# Altium project EV06P90A_EVB-LAN8670-RMII.PrjPCB
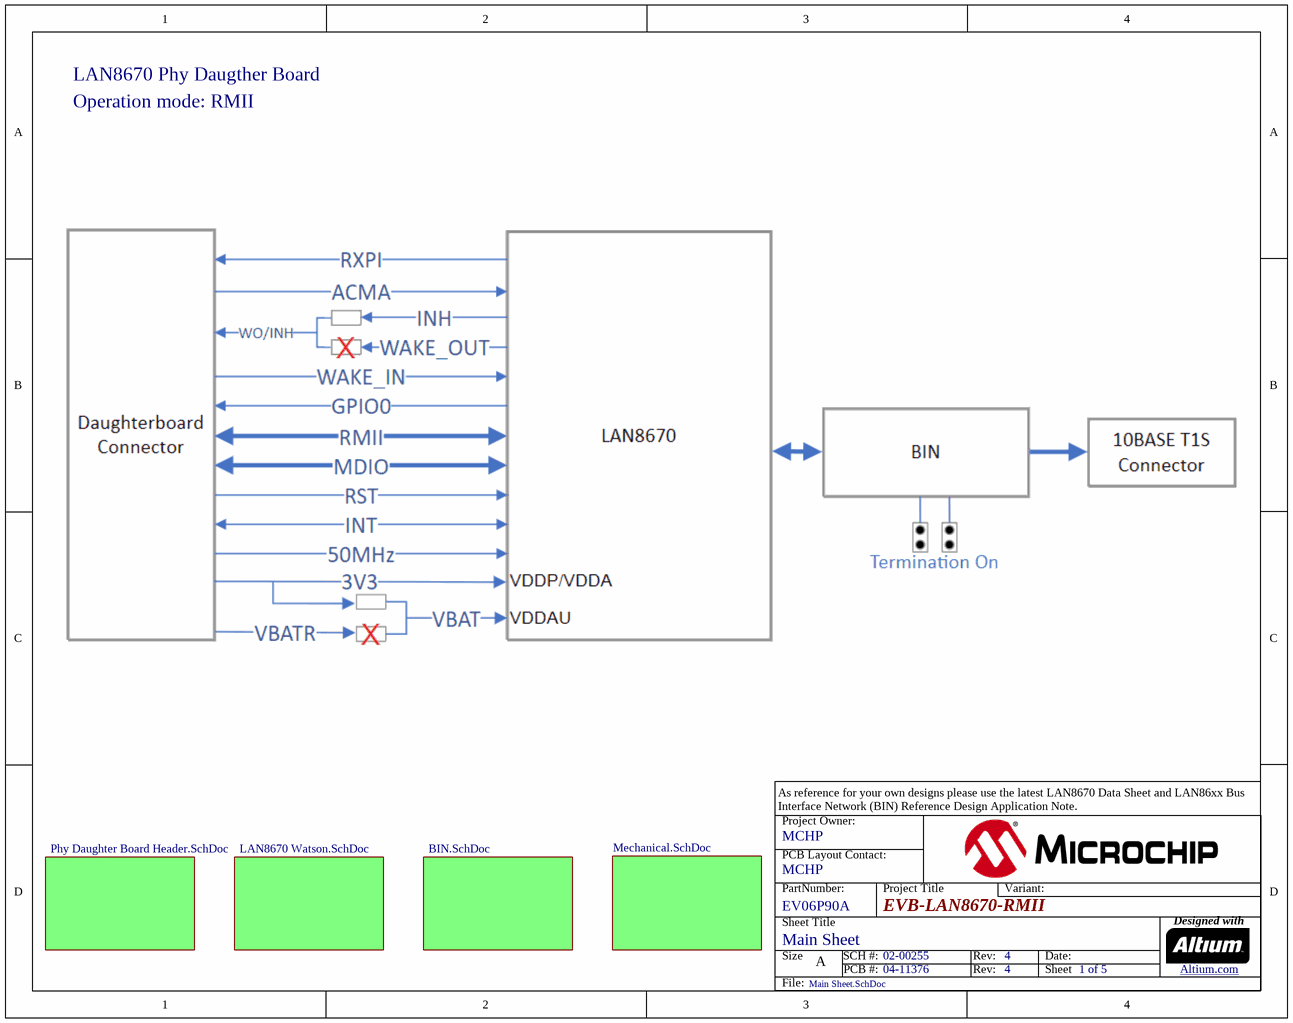
[diagram p0: Main Sheet.SchDoc]
ProjectTitle: EVB-LAN8670-RMII; ProjectPCBFabRevision: 4; ProjectPCBFabNumber: 04-11376; ProjectPCBAssyRevision: 4; ProjectPCBAssyNumber: 02-00255; ProjectPartNumber: EV06P90A; ProjectContactPCB: MCHP; ProjectContactOwner: MCHP
5 sheets, 76 parts. Net scope: global (net labels, ports and power ports of the same name join across sheets).
Board file: 04-11376.PcbDoc
Sheets:
  Main Sheet.SchDoc
     = BIN.SchDoc
     = Phy Daughter Board Header.SchDoc
     = LAN8670 Watson.SchDoc
     = Mechanical.SchDoc

## Sheet Main Sheet.SchDoc
size A; CompanyName: Microchip Technology Inc.; Organization: Microchip Technology; Address1: 2355 West Chandler Blvd.; Address2: Chandler, AZ  85224; Address4: USA; DocumentNumber: 1; SheetNumber: 1; SheetTotal: 5; SheetTitle: Main Sheet; Time: Time

### Sub-sheets
? = BIN.SchDoc: no entries
? = Phy Daughter Board Header.SchDoc: no entries
? = LAN8670 Watson.SchDoc: no entries
? = Mechanical.SchDoc: no entries

### Notes on the sheet
- LAN8670 Phy Daugther Board
- Operation mode: RMII
- As reference for your own designs please use the latest LAN8670 Data Sheet and LAN86xx Bus Interface Network (BIN) Reference Design Application Note.
- Project Owner:
- PCB Layout Contact:
- PartNumber:
- Project Title
- Variant:
- Sheet Title
- Size
- A
- SCH #:
- PCB #:
- Rev:
- Date:
- Sheet
- Designed with
- Altium.com <http://go.altium.com/MicrochipLandingPage_Evaluation.html>
- File:

## Sheet BIN.SchDoc
size A; CompanyName: Microchip Technology Inc.; Organization: Microchip Technology; Address1: 2355 West Chandler Blvd.; Address2: Chandler, AZ  85224; Address4: USA; DocumentNumber: 4; SheetNumber: 4; SheetTotal: 5; SheetTitle: Bus Interface Network; Time: Time
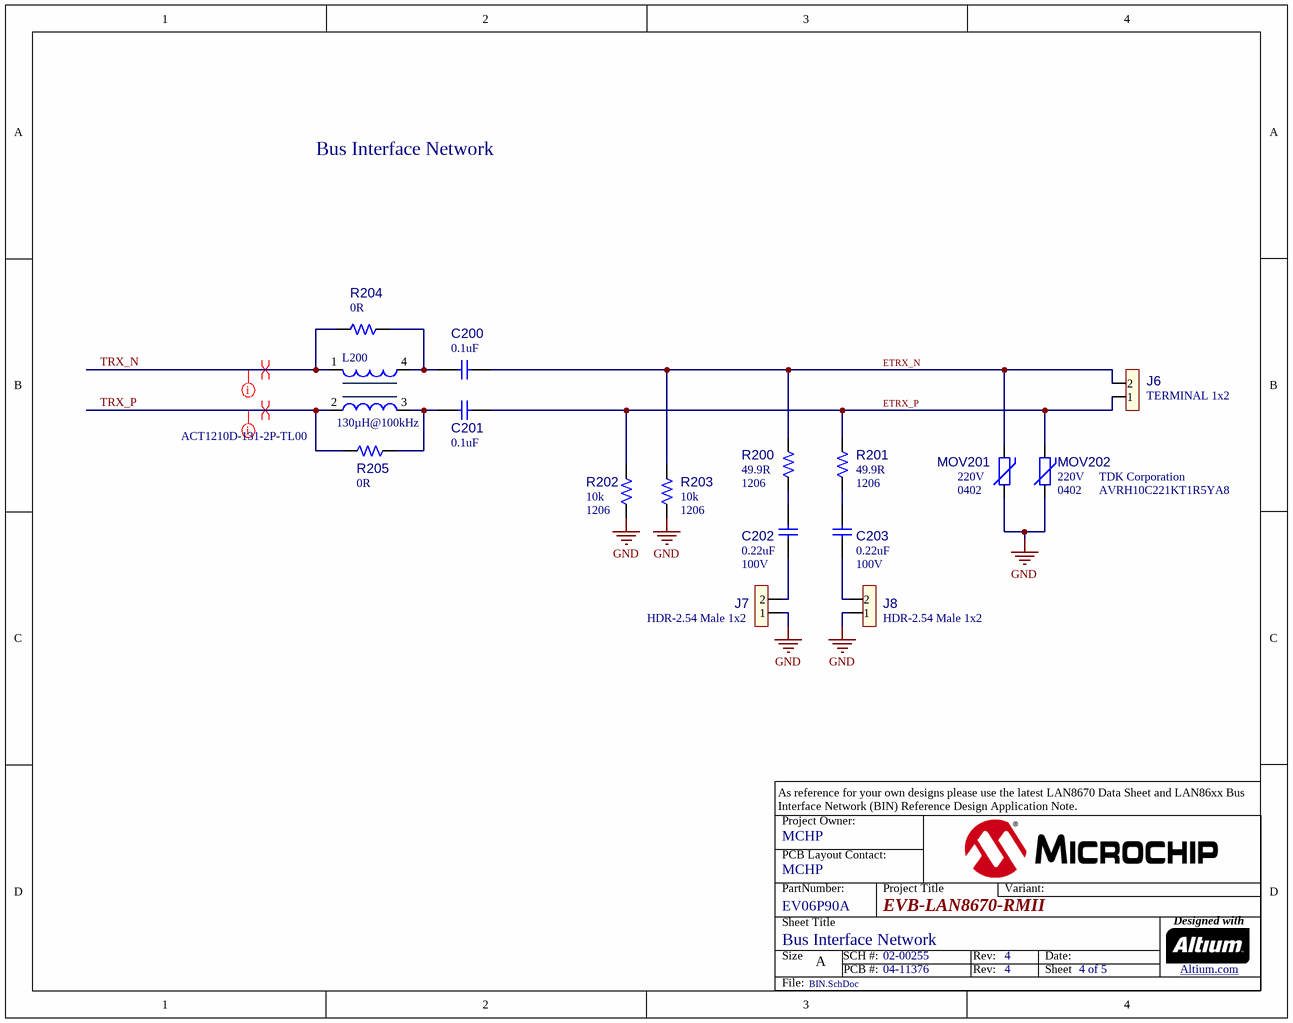
[diagram p1: BIN.SchDoc]

### Parts
C200  value 0.1uF  [CAP_C_0402]  (hidden comment: Capacitor NP)
C201  value 0.1uF  [CAP_C_0402]  (hidden comment: Capacitor NP)
C202  value 0.22uF  Voltage: 100V  [CAP_C_0805]  (hidden comment: Capacitor NP)
C203  value 0.22uF  Voltage: 100V  [CAP_C_0805]  (hidden comment: Capacitor NP)
J6  value TERMINAL 1x2  [CON_TB_3.5mm_2POS_WE_WR-TBL-691214110002S]  (hidden comment: Header 1x2)
J7  value HDR-2.54 Male 1x2  [HDR_M_2.54_1x2]  (hidden comment: Header 1x2)
J8  value HDR-2.54 Male 1x2  [HDR_M_2.54_1x2]  (hidden comment: Header 1x2)
L200  value 130µH@100kHz  Manufacturer Part Number 1: ACT1210D-131-2P-TL00  [IND_TDK_ACT1210D_L3.9W2.5H2.5]  (hidden comment: Inductor Choke ACT1210)
MOV201  value 220V  Package: 0402  [RES_C_0402]  (hidden comment: Varistor)
MOV202  value 220V  Package: 0402  Manufacturer 1: TDK Corporation  Manufacturer Part Number 1: AVRH10C221KT1R5YA8  [RES_C_0402]  (hidden comment: Varistor)
R200  value 49.9R  Package: 1206  [RES_C_1206]  (hidden comment: Resistor)
R201  value 49.9R  Package: 1206  [RES_C_1206]  (hidden comment: Resistor)
R202  value 10k  Package: 1206  [RES_C_1206]  (hidden comment: Resistor)
R203  value 10k  Package: 1206  [RES_C_1206]  (hidden comment: Resistor)
R204  value 0R  [RES_C_0402]  (hidden comment: Resistor)
R205  value 0R  [RES_C_0402]  (hidden comment: Resistor)

### Nets
GND: J7.1 J8.1 MOV201.1 MOV202.1 R202.2 R203.2
ETRX_N: C200.2 J6.2 MOV201.2 R200.2 R203.1
ETRX_P: C201.2 J6.1 MOV202.2 R201.2 R202.1
TRX_N: L200.1 R204.1
TRX_P: L200.2 R205.1
NetC200_1: C200.1 L200.4 R204.2
NetC201_1: C201.1 L200.3 R205.2
NetC202_1: C202.1 J7.2
NetC202_2: C202.2 R200.1
NetC203_1: C203.1 J8.2
NetC203_2: C203.2 R201.1

### Layout directives
differential pair: TRX_N, TRX_P
net class 100 Ohm Diff: TRX_N, TRX_P

### Notes on the sheet
- As reference for your own designs please use the latest LAN8670 Data Sheet and LAN86xx Bus Interface Network (BIN) Reference Design Application Note.
- Project Owner:
- PCB Layout Contact:
- PartNumber:
- Project Title
- Variant:
- Sheet Title
- Size
- A
- SCH #:
- PCB #:
- Rev:
- Date:
- Sheet
- Designed with
- Altium.com <http://go.altium.com/MicrochipLandingPage_Evaluation.html>
- File:

### Library data of the parts
C200 C201 = CAP2375: Manufacturer 1: Murata Electronics; Manufacturer Part Number 1: GRM155R71H104KE14J; Voltage: 50V; Tolerance: 10%; Description_: Ceramic capacitor, SMD 0402, X7R, 50V, +/-10%; Temperature Coeffcient: X7R; Type: Ceramic; Owner: Dragos Danaila; Populated: YES; Dev Tools Status: Production; MCHP-ID: CAP2375; Revision: 1; Status: MCL Design; Package: 0402; Operating Temperature: -55C to +125C; Category: Capacitor; Supplier 1: Mouser Electronics; Supplier Part Number 1: 81-GRM155R71H104KE4J; Quantity Override: 1; Symbol: Capacitor NP; ComponentLink1URL: https://chn-vm-apps.microchip.com/mchprepo/parts/Datasheets/murata_03052018_GRM_Series_1-1310166.pdf; ComponentLink1Description: SVN Datasheet; ComponentLink2URL: C:\ALTIUM_WORK\00001_MCHP-CDB\Datasheets\murata_03052018_GRM_Series_1-1310166.pdf; ComponentLink2Description: Local Datasheet; ComponentLink3URL: C:\ALTIUM_WORK\00001_MCHP-CDB\Library\LibraryRefs\Capacitor NP.SchLib; ComponentLink3Description: Open Symbol; ComponentLink4URL: C:\ALTIUM_WORK\00001_MCHP-CDB\Library\Footprints\CAP_C_0402.PcbLib; ComponentLink4Description: Open Footprint; ComponentLink5Description: Open Footprint 2; ComponentLink6Description: Open Footprint 3; ComponentLink7Description: Open Footprint 4
C202 C203 = CAP2522: Manufacturer 1: AVX Corporation; Manufacturer Part Number 1: 08051C224K4T2A; Description_: CAP CER 0.22uF 100V 10% X7R SMD 0805 AEC-Q200; Tolerance: ±10%; Type: Ceramic; Owner: Lori Graham; Populated: YES; Temperature Coeffcient: X7R; Dev Tools Status: Design; MCHP-ID: CAP2522; Package: 0805; Revision: 1; Status: MCL Design; Operating Temperature: -55°C to +125°C; Category: Capacitor; Supplier 1: Digi-Key; Supplier Part Number 1: 478-13049-1-ND; Quantity Override: 1; Symbol: Capacitor NP; ComponentLink1URL: https://chn-vm-apps.microchip.com/mchprepo/parts/Datasheets/AVX_08051C224K4T2A; ComponentLink1Description: SVN Datasheet; ComponentLink2URL: C:\ALTIUM_WORK\00001_MCHP-CDB\Datasheets\AVX_08051C224K4T2A; ComponentLink2Description: Local Datasheet; ComponentLink3URL: C:\ALTIUM_WORK\00001_MCHP-CDB\Library\LibraryRefs\Capacitor NP.SchLib; ComponentLink3Description: Open Symbol; ComponentLink4URL: C:\ALTIUM_WORK\00001_MCHP-CDB\Library\Footprints\CAP_C_0805.PcbLib; ComponentLink4Description: Open Footprint; ComponentLink5Description: Open Footprint 2; ComponentLink6Description: Open Footprint 3; ComponentLink7Description: Open Footprint 4
J6 = CON2397: Manufacturer 1: WUERTH ELEKTRONIK; Manufacturer Part Number 1: 691214110002S; Description_: CON TERMINAL 3.5mm 1x2 Female 16-30AWG 10A TH R/A; Owner: Lori Graham; Populated: YES; Dev Tools Status: Design; Voltage: 300V; Current: 10A; MCHP-ID: CON2397; Revision: 1; Status: MCL Design; Type: Terminal Block; Category: Connector; Supplier 1: Digi-Key; Supplier Part Number 1: 732-691214110002S-ND; Quantity Override: 1; Symbol: Header 1x2; ComponentLink1URL: https://chn-vm-apps.microchip.com/mchprepo/parts/Datasheets/6912141100xxS.pdf; ComponentLink1Description: SVN Datasheet; ComponentLink2URL: C:\ALTIUM_WORK\00001_MCHP-CDB\Datasheets\6912141100xxS.pdf; ComponentLink2Description: Local Datasheet; ComponentLink3URL: C:\ALTIUM_WORK\00001_MCHP-CDB\Library\LibraryRefs\Header 1x2.SchLib; ComponentLink3Description: Open Symbol; ComponentLink4URL: C:\ALTIUM_WORK\00001_MCHP-CDB\Library\Footprints\CON_TB_3.5mm_2POS_WE_WR-TBL-691214110002S.PcbLib; ComponentLink4Description: Open Footprint; ComponentLink5Description: Open Footprint 2; ComponentLink6Description: Open Footprint 3; ComponentLink7Description: Open Footprint 4; Operating Temperature: -30C to +120C
J7 J8 = CON2326: Manufacturer 1: Samtec Inc; Manufacturer Part Number 1: TSW-102-23-F-S; Description_: CON HDR-2.54 M 1x2 5.84MH TH VERT; Owner: Lori Graham; Populated: YES; Dev Tools Status: Design; MCHP-ID: CON2326; Revision: 1; Status: MCL Design; Type: Header 2.54mm; Category: Connector; Supplier 1: Digi-Key; Supplier Part Number 1: SAM10326-ND; Quantity Override: 1; Symbol: Header 1x2; ComponentLink1URL: https://chn-vm-apps.microchip.com/mchprepo/parts/Datasheets/Samtec_TSW_102-23-F-S; ComponentLink1Description: SVN Datasheet; ComponentLink2URL: C:\ALTIUM_WORK\00001_MCHP-CDB\Datasheets\Samtec_TSW_102-23-F-S; ComponentLink2Description: Local Datasheet; ComponentLink3URL: C:\ALTIUM_WORK\00001_MCHP-CDB\Library\LibraryRefs\Header 1x2.SchLib; ComponentLink3Description: Open Symbol; ComponentLink4URL: C:\ALTIUM_WORK\00001_MCHP-CDB\Library\Footprints\HDR_M_2.54_1x2.PcbLib; ComponentLink4Description: Open Footprint; ComponentLink5Description: Open Footprint 2; ComponentLink6Description: Open Footprint 3; ComponentLink7Description: Open Footprint 4; Operating Temperature: -55°C ~ 125°C
L200 = IND1953: Manufacturer 1: TDK Corporation; Description_: CM CHOKE 6.7k@10MHz 3.5R SMD 1210 AEC-Q200; Type: CM Choke; Owner: Joerg Buehrer; DCR: 3.5R; Dev Tools Status: Design; Test Frequency: 10MHz; Populated: YES; BOM Notes: Alternate:  ACT1210D-101-2P-TL00 or ACT1210R-101-2P-TL00; MCHP-ID: IND1953; Revision: 2; Status: MCL Design; Operating Temperature: -40°C ~ 150°C; Package: 1210; Category: Inductor; Supplier 1: TDK Corporation; Supplier Part Number 1: ACT1210D-131-2P-TL00; Quantity Override: 1; Symbol: Inductor Choke ACT1210; ComponentLink1URL: https://chn-vm-apps.microchip.com/mchprepo/parts/Datasheets/cmf_automotive_signal_act1210d_en.pdf; ComponentLink1Description: SVN Datasheet; ComponentLink2URL: C:\ALTIUM_WORK\00001_MCHP-CDB\Datasheets\cmf_automotive_signal_act1210d_en.pdf; ComponentLink2Description: Local Datasheet; ComponentLink3URL: C:\ALTIUM_WORK\00001_MCHP-CDB\Library\LibraryRefs\Inductor Choke ACT1210.SchLib; ComponentLink3Description: Open Symbol; ComponentLink4URL: C:\ALTIUM_WORK\00001_MCHP-CDB\Library\Footprints\IND_TDK_ACT1210D_L3.9W2.5H2.5.PcbLib; ComponentLink4Description: Open Footprint; ComponentLink5Description: Open Footprint 2; ComponentLink6Description: Open Footprint 3; ComponentLink7Description: Open Footprint 4
MOV201 = RES2490: Manufacturer 1: TDK Corporation; Manufacturer Part Number 1: AVRH10C221KT1R5YA8; Description_: RES VARISTOR C 220V 0.01J SMD 0402; Dev Tools Status: Design; Current: 1A; Owner: Sam Charles; Populated: YES; MCHP-ID: RES2490; Revision: 1; Symbol: Varistor; Status: MCL Design; ComponentLink1URL: https://chn-vm-apps.microchip.com/mchprepo/parts/Datasheets/vpd_automotive_varistors_avr_en.pdf; ComponentLink1Description: SVN Datasheet; ComponentLink2URL: C:\ALTIUM_WORK\00001_MCHP-CDB\Datasheets\vpd_automotive_varistors_avr_en.pdf; ComponentLink2Description: Local Datasheet; ComponentLink3URL: C:\ALTIUM_WORK\00001_MCHP-CDB\Library\LibraryRefs\Varistor.SchLib; ComponentLink3Description: Open Symbol; ComponentLink4URL: C:\ALTIUM_WORK\00001_MCHP-CDB\Library\Footprints\RES_C_0402.PcbLib; ComponentLink4Description: Open Footprint; ComponentLink5Description: Open Footprint 2; ComponentLink6Description: Open Footprint 3; ComponentLink7Description: Open Footprint 4; Operating Temperature: -55°C ~ 150°C; Category: Resistor; Type: Varistor; Voltage: 220V; Composition: C; Supplier 1: Digi-Key; Supplier Part Number 1: 445-AVRH10C221KT1R5YA8CT-ND; Quantity Override: 1
MOV202 = RES2490: Description_: RES VARISTOR C 220V 0.01J SMD 0402; Dev Tools Status: Design; Current: 1A; Owner: Sam Charles; Populated: YES; MCHP-ID: RES2490; Revision: 1; Symbol: Varistor; Status: MCL Design; ComponentLink1URL: https://chn-vm-apps.microchip.com/mchprepo/parts/Datasheets/vpd_automotive_varistors_avr_en.pdf; ComponentLink1Description: SVN Datasheet; ComponentLink2URL: C:\ALTIUM_WORK\00001_MCHP-CDB\Datasheets\vpd_automotive_varistors_avr_en.pdf; ComponentLink2Description: Local Datasheet; ComponentLink3URL: C:\ALTIUM_WORK\00001_MCHP-CDB\Library\LibraryRefs\Varistor.SchLib; ComponentLink3Description: Open Symbol; ComponentLink4URL: C:\ALTIUM_WORK\00001_MCHP-CDB\Library\Footprints\RES_C_0402.PcbLib; ComponentLink4Description: Open Footprint; ComponentLink5Description: Open Footprint 2; ComponentLink6Description: Open Footprint 3; ComponentLink7Description: Open Footprint 4; Operating Temperature: -55°C ~ 150°C; Category: Resistor; Type: Varistor; Voltage: 220V; Composition: C; Supplier 1: Digi-Key; Supplier Part Number 1: 445-AVRH10C221KT1R5YA8CT-ND; Quantity Override: 1
R200 R201 = RES2766: Manufacturer 1: Vishay Dale; Manufacturer Part Number 1: TNPW120649R9BEEA; Description_: RES TF 49.9R 0.1% 0.4W SMD 1206 AEC-Q200; Voltage: 200V; Tolerance: ±0.1%; Temperature Coeffcient: ±25ppm/°C; Power: 0.4W, 2/5W; Owner: Lori Graham; Populated: YES; Dev Tools Status: Design; MCHP-ID: RES2766; Revision: 2; Status: MCL Design; Operating Temperature: -55°C to +155°C; Category: Resistor; Type: RES SMD; Composition: TF; Supplier 1: Digi-Key; Supplier Part Number 1: TNP49.9ACCT-ND; Quantity Override: 1; Symbol: Resistor; ComponentLink1URL: https://chn-vm-apps.microchip.com/mchprepo/parts/Datasheets/tnpw_e3; ComponentLink1Description: SVN Datasheet; ComponentLink2URL: C:\ALTIUM_WORK\00001_MCHP-CDB\Datasheets\tnpw_e3; ComponentLink2Description: Local Datasheet; ComponentLink3URL: C:\ALTIUM_WORK\00001_MCHP-CDB\Library\LibraryRefs\Resistor.SchLib; ComponentLink3Description: Open Symbol; ComponentLink4URL: C:\ALTIUM_WORK\00001_MCHP-CDB\Library\Footprints\RES_C_1206.PcbLib; ComponentLink4Description: Open Footprint; ComponentLink5Description: Open Footprint 2; ComponentLink6Description: Open Footprint 3; ComponentLink7Description: Open Footprint 4
R202 R203 = RES2292: Manufacturer 1: Panasonic Electronic Components; Manufacturer Part Number 1: ERJ-8ENF1002V; Tolerance: 1%; Description_: RES TKF 10k 1% 1/4W SMD 1206 AEC-Q200; Dev Tools Status: Design; Temperature Coeffcient: 100ppm/C; Power: 1/4W; Owner: Gabor Bihari; Populated: YES; MCHP-ID: RES2292; Revision: A; Status: MCL Design; ComponentLink1URL: https://chn-vm-apps.microchip.com/mchprepo/parts/Datasheets/AOA0000C304.pdf; ComponentLink1Description: SVN Datasheet; Operating Temperature: -55°C - 155°C; Category: Resistor; Type: RES SMD; Composition: TKF; Supplier 1: Digi-Key; Supplier Part Number 1: P10.0KFCT-ND; Quantity Override: 1; Symbol: Resistor; ComponentLink2URL: C:\ALTIUM_WORK\00001_MCHP-CDB\Datasheets\AOA0000C304.pdf; ComponentLink2Description: Local Datasheet; ComponentLink3URL: C:\ALTIUM_WORK\00001_MCHP-CDB\Library\LibraryRefs\Resistor.SchLib; ComponentLink3Description: Open Symbol; ComponentLink4URL: C:\ALTIUM_WORK\00001_MCHP-CDB\Library\Footprints\RES_C_1206.PcbLib; ComponentLink4Description: Open Footprint; ComponentLink5Description: Open Footprint 2; ComponentLink6Description: Open Footprint 3; ComponentLink7Description: Open Footprint 4
R204 R205 = RSMT1246: Manufacturer 1: Panasonic Electronic Components; Manufacturer Part Number 1: ERJ-2GE0R00X; Tolerance: 50mOhm; Description_: RES TKF 0R 1/10W SMD 0402; Dev Tools Status: Design; Voltage: 50V; Current: 1A; Power: 1/10W; Owner: Dragos Danaila; Populated: Yes; MCHP-ID: RSMT1246; Package: 0402; Revision: A; Symbol: Resistor; Status: MCL Design; ComponentLink1URL: https://chn-vm-apps.microchip.com/mchprepo/parts/Datasheets/DMA0000COL9.pdf; ComponentLink1Description: SVN Datasheet; ComponentLink2URL: C:\ALTIUM_WORK\00001_MCHP-CDB\Datasheets\DMA0000COL9.pdf; ComponentLink2Description: Local Datasheet; ComponentLink3URL: C:\ALTIUM_WORK\00001_MCHP-CDB\Library\LibraryRefs\Resistor.SchLib; ComponentLink3Description: Open Symbol; ComponentLink4URL: C:\ALTIUM_WORK\00001_MCHP-CDB\Library\Footprints\RES_C_0402.PcbLib; ComponentLink4Description: Open Footprint; ComponentLink5Description: Open Footprint 2; ComponentLink6Description: Open Footprint 3; ComponentLink7Description: Open Footprint 4; Operating Temperature: -55C to +155C; Category: Resistor; Type: RES SMD; Composition: TKF; Supplier 1: Digi-Key; Supplier Part Number 1: P0.0JCT-ND; Quantity Override: 1

## Sheet Phy Daughter Board Header.SchDoc
size A; CompanyName: Microchip Technology Inc.; Organization: Microchip Technology; Address1: 2355 West Chandler Blvd.; Address2: Chandler, AZ  85224; Address4: USA; DocumentNumber: 2; SheetNumber: 2; SheetTotal: 5; SheetTitle: Phy Daughter Board Header; Time: Time
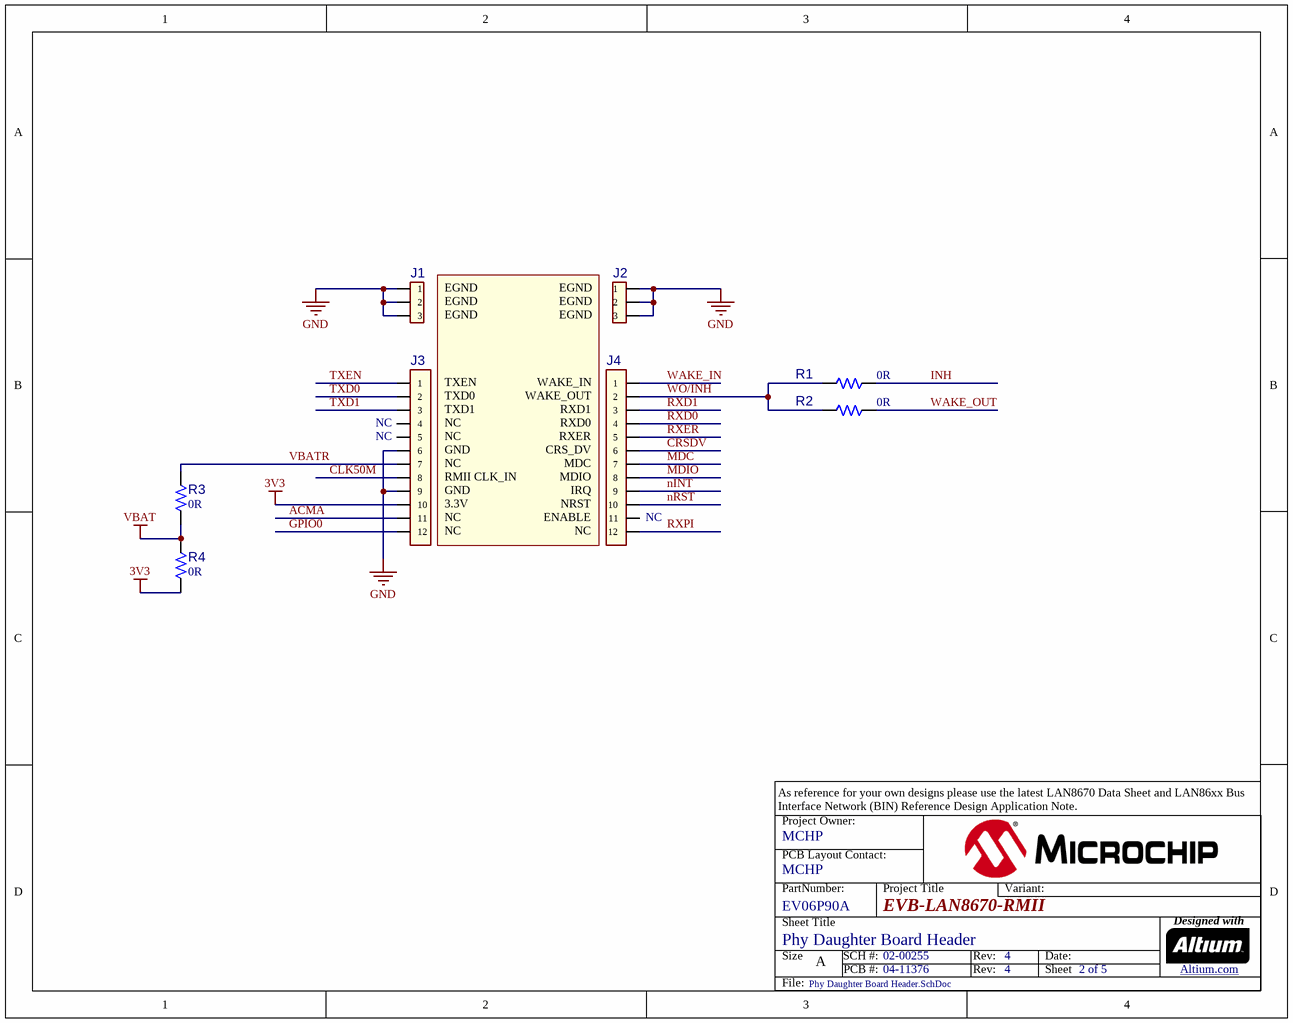
[diagram p2: Phy Daughter Board Header.SchDoc]

### Parts
J1  Header 1x3  [HDR_M_1.27_1x3_TMS_103-02_L_S]  (value not drawn)
J2  Header 1x3  [HDR_M_1.27_1x3_TMS_103-02_L_S]  (value not drawn)
J3  Header 1x12  [HDR_M_1.27_1x12]  (value not drawn)
J4  Header 1x12  [HDR_M_1.27_1x12]  (value not drawn)
R1  value 0R  [RES_C_0402]  (hidden comment: Resistor)
R2  value 0R  [RES_C_0402]  (hidden comment: Resistor)
R3  value 0R  [RES_C_0603]  (hidden comment: Resistor)
R4  value 0R  [RES_C_0603]  (hidden comment: Resistor)

### Nets
3V3: J3.10 R4.1
GND: J1.1 J1.2 J1.3 J2.1 J2.2 J2.3 J3.6 J3.9
VBAT: R3.1 R4.2
ACMA: J3.11
CLK50M: J3.8
CRSDV: J4.6
GPIO0: J3.12
INH: R1.2
MDC: J4.7
MDIO: J4.8
nINT: J4.9
nRST: J4.10
RXD0: J4.4
RXD1: J4.3
RXER: J4.5
RXPI: J4.12
TXD0: J3.2
TXD1: J3.3
TXEN: J3.1
VBATR: J3.7 R3.2
WAKE_IN: J4.1
WAKE_OUT: R2.2
WO/INH: J4.2 R1.1 R2.1

Not connected (* = marked no-connect by the designer): J3 4 5; J4 11

### Notes on the sheet
- (near J1) EGND
- (near J2) EGND
- (near J3) NC
- (near J3) TXEN
- (near J3) TXD0
- (near J3) TXD1
- (near J4) WAKE_IN
- (near J4) WAKE_OUT
- (near J4) RXD1
- (near J4) RXD0
- (near J3) GND
- (near J3) RMII CLK_IN
- (near J3) 3.3V
- (near J4) RXER
- (near J4) CRS_DV
- (near J4) MDC
- (near J4) MDIO
- (near J4) IRQ
- (near J4) NRST
- (near J4) ENABLE
- (near J4) NC
- As reference for your own designs please use the latest LAN8670 Data Sheet and LAN86xx Bus Interface Network (BIN) Reference Design Application Note.
- Project Owner:
- PCB Layout Contact:
- PartNumber:
- Project Title
- Variant:
- Sheet Title
- Size
- A
- SCH #:
- PCB #:
- Rev:
- Date:
- Sheet
- Designed with
- Altium.com <http://go.altium.com/MicrochipLandingPage_Evaluation.html>
- File:

### Library data of the parts
J1 J2 = CON1213: Manufacturer 1: Samtec; Manufacturer Part Number 1: TMS-103-02-L-S; Description_: CON HDR-1.27 Male 1X3 TH VERT; Owner: Leah Whitaker; Populated: YES; Dev Tools Status: Production; MCHP-ID: CON1213; Revision: 0; Status: MCL Design; Type: Header 1.27mm; Category: Connector; Supplier 1: Samtec; Supplier Part Number 1: TMS-103-02-L-S; Quantity Override: 1; Symbol: Header 1X3; ComponentLink1Description: SVN Datasheet; ComponentLink2Description: Local Datasheet; ComponentLink3URL: C:\ALTIUM_WORK\00001_MCHP-CDB\Library\LibraryRefs\Header 1X3.SchLib; ComponentLink3Description: Open Symbol; ComponentLink4URL: C:\ALTIUM_WORK\00001_MCHP-CDB\Library\Footprints\HDR_M_1.27_1x3_TMS_103-02_L_S.PcbLib; ComponentLink4Description: Open Footprint; ComponentLink5Description: Open Footprint 2; ComponentLink6Description: Open Footprint 3; ComponentLink7Description: Open Footprint 4
J3 J4 = CON1212: Manufacturer 1: Samtec; Manufacturer Part Number 1: TMS-112-02-L-S; Description_: CON HDR-1.27 Male 1X12 TH VERT; Owner: Leah Whitaker; Populated: YES; Dev Tools Status: Production; MCHP-ID: CON1212; Revision: 0; Status: MCL Design; Type: Header 1.27mm; Category: Connector; Supplier 1: Samtec; Supplier Part Number 1: TMS-112-02-L-S; Quantity Override: 1; Symbol: Header 1X12; ComponentLink1Description: SVN Datasheet; ComponentLink2Description: Local Datasheet; ComponentLink3URL: C:\ALTIUM_WORK\00001_MCHP-CDB\Library\LibraryRefs\Header 1X12.SchLib; ComponentLink3Description: Open Symbol; ComponentLink4URL: C:\ALTIUM_WORK\00001_MCHP-CDB\Library\Footprints\HDR_M_1.27_1x12.PcbLib; ComponentLink4Description: Open Footprint; ComponentLink5Description: Open Footprint 2; ComponentLink6Description: Open Footprint 3; ComponentLink7Description: Open Footprint 4
R1 R2 = RSMT1246: Manufacturer 1: Panasonic Electronic Components; Manufacturer Part Number 1: ERJ-2GE0R00X; Description_: RES TKF 0R 1/10W SMD 0402; Tolerance: 50mOhm; Power: 1/10W; Owner: Dragos Danaila; Populated: YES; Dev Tools Status: Production; Voltage: 50V; Current: 1A; MCHP-ID: RSMT1246; Revision: 1; Status: MCL Design; Package: 0402; Operating Temperature: -55C to +155C; Category: Resistor; Type: RES SMD; Composition: TKF; Supplier 1: Digi-Key; Supplier Part Number 1: P0.0JCT-ND; Quantity Override: 1; Symbol: Resistor; ComponentLink1URL: https://chn-vm-apps.microchip.com/mchprepo/parts/Datasheets/DMA0000COL9.pdf; ComponentLink1Description: SVN Datasheet; ComponentLink2URL: C:\ALTIUM_WORK\00001_MCHP-CDB\Datasheets\DMA0000COL9.pdf; ComponentLink2Description: Local Datasheet; ComponentLink3URL: C:\ALTIUM_WORK\00001_MCHP-CDB\Library\LibraryRefs\Resistor.SchLib; ComponentLink3Description: Open Symbol; ComponentLink4URL: C:\ALTIUM_WORK\00001_MCHP-CDB\Library\Footprints\RES_C_0402.PcbLib; ComponentLink4Description: Open Footprint; ComponentLink5Description: Open Footprint 2; ComponentLink6Description: Open Footprint 3; ComponentLink7Description: Open Footprint 4
R3 R4 = RES2360: Manufacturer 1: Panasonic Electronic Components; Manufacturer Part Number 1: ERJ-3GEY0R00V; Description_: RES TKF 0R 1/10W SMD 0603 AEC-Q200; Power: 1/10W; Owner: Steve Dziaba; Populated: YES; Dev Tools Status: Production; Circuit Type: Isolated; MCHP-ID: RES2360; Revision: 1; Status: MCL Design; Package: 0603; Category: Resistor; Type: RES SMD; Composition: TKF; Supplier 1: Digi-Key; Supplier Part Number 1: P0.0GCT-ND; Quantity Override: 1; Symbol: Resistor; ComponentLink1URL: https://chn-vm-apps.microchip.com/mchprepo/parts/Datasheets/ERJ-3GEY0R00V.pdf; ComponentLink1Description: SVN Datasheet; ComponentLink2URL: C:\ALTIUM_WORK\00001_MCHP-CDB\Datasheets\ERJ-3GEY0R00V.pdf; ComponentLink2Description: Local Datasheet; ComponentLink3URL: C:\ALTIUM_WORK\00001_MCHP-CDB\Library\LibraryRefs\Resistor.SchLib; ComponentLink3Description: Open Symbol; ComponentLink4URL: C:\ALTIUM_WORK\00001_MCHP-CDB\Library\Footprints\RES_C_0603.PcbLib; ComponentLink4Description: Open Footprint; ComponentLink5Description: Open Footprint 2; ComponentLink6Description: Open Footprint 3; ComponentLink7Description: Open Footprint 4; Manufacturer 2: Vishay; Manufacturer Part Number 2: CRCW06030000Z0EB; Supplier 2: Digi-Key; Supplier Part Number 2: 541-2968-1-ND

## Sheet LAN8670 Watson.SchDoc
size B; CompanyName: Microchip Technology Inc.; Organization: Microchip Technology; Address1: 2355 West Chandler Blvd.; Address2: Chandler, AZ  85224; Address4: USA; DocumentNumber: 3; SheetNumber: 3; SheetTotal: 5; SheetTitle: LAN8670; Time: Time
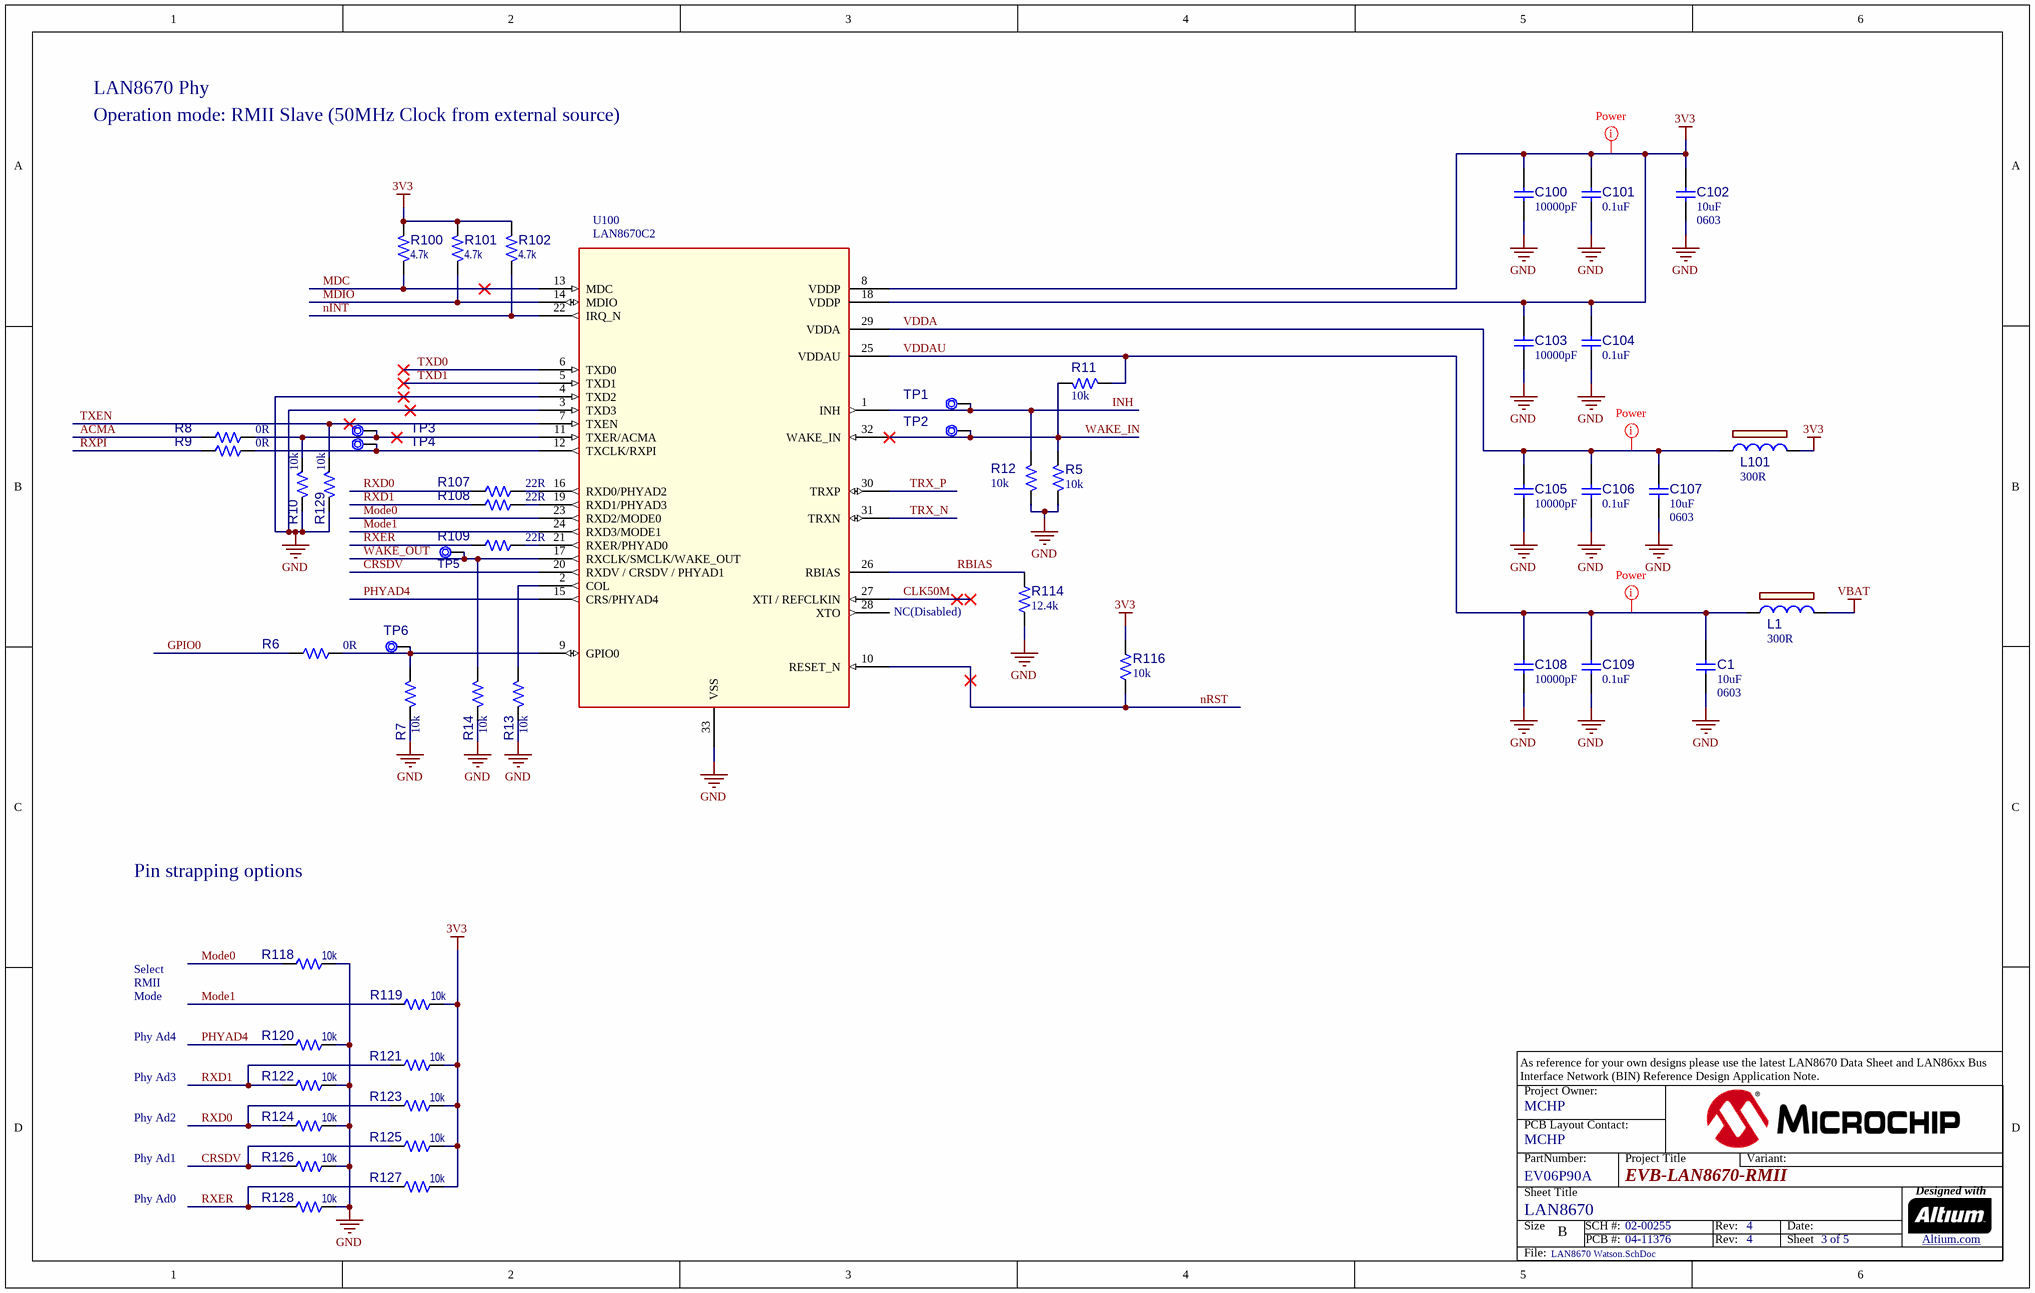
[diagram p3: LAN8670 Watson.SchDoc]

### Parts
C1  value 10uF  Package: 0603  [CAP_C_0603]  (hidden comment: Capacitor NP)
C100  value 10000pF  [CAP_C_0402]  (hidden comment: Capacitor NP)
C101  value 0.1uF  [CAP_C_0402]  (hidden comment: Capacitor NP)
C102  value 10uF  Package: 0603  [CAP_C_0603]  (hidden comment: Capacitor NP)
C103  value 10000pF  [CAP_C_0402]  (hidden comment: Capacitor NP)
C104  value 0.1uF  [CAP_C_0402]  (hidden comment: Capacitor NP)
C105  value 10000pF  [CAP_C_0402]  (hidden comment: Capacitor NP)
C106  value 0.1uF  [CAP_C_0402]  (hidden comment: Capacitor NP)
C107  value 10uF  Package: 0603  [CAP_C_0603]  (hidden comment: Capacitor NP)
C108  value 10000pF  [CAP_C_0402]  (hidden comment: Capacitor NP)
C109  value 0.1uF  [CAP_C_0402]  (hidden comment: Capacitor NP)
L1  value 300R  [IND_C_0603]  (hidden comment: Ferrite Bead)
L101  value 300R  [IND_C_0603]  (hidden comment: Ferrite Bead)
R5  value 10k  [RES_C_0402]  (hidden comment: Resistor)
R6  value 0R  [RES_C_0402]  (hidden comment: Resistor)
R7  value 10k  [RES_C_0402]  (hidden comment: Resistor)
R8  value 0R  [RES_C_0402]
R9  value 0R  [RES_C_0402]  (hidden comment: Resistor)
R10  value 10k  [RES_C_0402]  (hidden comment: Resistor)
R11  value 10k  [RES_C_0402]  (hidden comment: Resistor)
R12  value 10k  [RES_C_0402]  (hidden comment: Resistor)
R13  value 10k  [RES_C_0402]  (hidden comment: Resistor)
R14  value 10k  [RES_C_0402]  (hidden comment: Resistor)
R100  value 4.7k  [RES_C_0402]  (hidden comment: Resistor)
R101  value 4.7k  [RES_C_0402]  (hidden comment: Resistor)
R102  value 4.7k  [RES_C_0402]  (hidden comment: Resistor)
R107  value 22R  [RES_C_0402]  (hidden comment: Resistor)
R108  value 22R  [RES_C_0402]  (hidden comment: Resistor)
R109  value 22R  [RES_C_0402]  (hidden comment: Resistor)
R114  value 12.4k  [RES_C_0402]  (hidden comment: Resistor)
R116  value 10k  [RES_C_0402]  (hidden comment: Resistor)
R118  value 10k  [RES_C_0402]  (hidden comment: Resistor)
R119  value 10k  [RES_C_0402]  (hidden comment: Resistor)
R120  value 10k  [RES_C_0402]  (hidden comment: Resistor)
R121  value 10k  [RES_C_0402]  (hidden comment: Resistor)
R122  value 10k  [RES_C_0402]  (hidden comment: Resistor)
R123  value 10k  [RES_C_0402]  (hidden comment: Resistor)
R124  value 10k  [RES_C_0402]  (hidden comment: Resistor)
R125  value 10k  [RES_C_0402]  (hidden comment: Resistor)
R126  value 10k  [RES_C_0402]  (hidden comment: Resistor)
R127  value 10k  [RES_C_0402]  (hidden comment: Resistor)
R128  value 10k  [RES_C_0402]  (hidden comment: Resistor)
R129  value 10k  [RES_C_0402]  (hidden comment: Resistor)
TP1  Test Point No BOM  [TP_rd_0.5mm]  (value not drawn)  (no BOM)
TP2  Test Point No BOM  [TP_rd_0.5mm]  (value not drawn)  (no BOM)
TP3  Test Point No BOM  [TP_rd_0.5mm]  (value not drawn)  (no BOM)
TP4  Test Point No BOM  [TP_rd_0.5mm]  (value not drawn)  (no BOM)
TP5  Test Point No BOM  [TP_rd_0.5mm]  (value not drawn)  (no BOM)
TP6  Test Point No BOM  [TP_rd_0.5mm]  (value not drawn)  (no BOM)
U100  value LAN8670C2  [VQFN-32_5x5_EP3.3x3.3]  (hidden comment: LAN8670C VQFN-32)

### Nets
3V3: C100.2 C101.2 C102.2 C103.2 C104.2 L101.2 R100.2 R101.2 R102.2 R116.2 R119.2 R121.2 R123.2 R125.2 R127.2 U100.8(VDDP) U100.18(VDDP)
GND: C1.1 C100.1 C101.1 C102.1 C103.1 C104.1 C105.1 C106.1 C107.1 C108.1 C109.1 R5.1 R7.1 R10.1 R12.1 R13.1 R14.1 R114.1 R118.2 R120.2 R122.2 R124.2 R126.2 R128.2 R129.1 U100.3(TXD3) U100.4(TXD2) U100.33(VSS)
VBAT: L1.2
ACMA: R8.1
CLK50M: U100.27(XTI_/_REFCLKIN)
CRSDV: R125.1 R126.1 U100.20(RXDV_/_CRSDV_/_PHYAD1)
GPIO0: R6.1
INH: R12.2 TP1.1 U100.1(INH)
MDC: R100.1 U100.13(MDC)
MDIO: R101.1 U100.14(MDIO)
Mode0: R118.1 U100.23(RXD2/MODE0)
Mode1: R119.1 U100.24(RXD3/MODE1)
nINT: R102.1 U100.22(IRQ_N)
nRST: R116.1 U100.10(RESET_N)
PHYAD4: R120.1 U100.15(CRS/PHYAD4)
RBIAS: R114.2 U100.26(RBIAS)
RXD0: R107.1 R123.1 R124.1
RXD1: R108.1 R121.1 R122.1
RXER: R109.1 R127.1 R128.1
RXPI: R9.1
TRX_N: U100.31(TRXN)
TRX_P: U100.30(TRXP)
TXD0: U100.6(TXD0)
TXD1: U100.5(TXD1)
TXEN: R129.2 U100.7(TXEN)
VDDA: C105.2 C106.2 C107.2 L101.1 U100.29(VDDA)
VDDAU: C1.2 C108.2 C109.2 L1.1 R11.1 U100.25(VDDAU)
WAKE_IN: R5.2 R11.2 TP2.1 U100.32(WAKE_IN)
WAKE_OUT: R14.2 TP5.1 U100.17(RXCLK/SMCLK/WAKE_OUT)
NetR6_2: R6.2 R7.2 TP6.1 U100.9(GPIO0)
NetR8_2: R8.2 R10.2 TP3.1 U100.11(TXER/ACMA)
NetR9_2: R9.2 TP4.1 U100.12(TXCLK/RXPI)
NetR13_2: R13.2 U100.2(COL)
NetR107_2: R107.2 U100.16(RXD0/PHYAD2)
NetR108_2: R108.2 U100.19(RXD1/PHYAD3)
NetR109_2: R109.2 U100.21(RXER/PHYAD0)

Not connected (* = marked no-connect by the designer): U100 28(XTO)

### Layout directives
net class Power: 3V3, VDDA, VDDAU

### Notes on the sheet
- LAN8670 Phy
- Operation mode: RMII Slave (50MHz Clock from external source)
- NC(Disabled)
- Pin strapping options
- Select
- RMII
- Mode
- Phy Ad4
- Phy Ad3
- As reference for your own designs please use the latest LAN8670 Data Sheet and LAN86xx Bus Interface Network (BIN) Reference Design Application Note.
- Phy Ad2
- Phy Ad1
- Phy Ad0
- Project Owner:
- PCB Layout Contact:
- PartNumber:
- Project Title
- Variant:
- Sheet Title
- Size
- B
- SCH #:
- PCB #:
- Rev:
- Date:
- Sheet
- Designed with
- Altium.com <http://go.altium.com/MicrochipLandingPage_Evaluation.html>
- File:

### Library data of the parts
C1 = CAP0542: Manufacturer 1: Samsung; Manufacturer Part Number 1: CL10A106MP8NNNC; Voltage: 10V; Description_: CAP CER 10uF 10V 20% X5R SMD 0603; Dev Tools Status: Production; Tolerance: 20%; Type: Ceramic; Populated: Yes; Temperature Coefficient: X5R; MCHP-ID: CAP0542; Revision: 2; Symbol: Capacitor NP; Status: MCL Design; ComponentLink1URL: https://chn-vm-apps.microchip.com/mchprepo/parts/Datasheets/ECJ__General_.pdf; ComponentLink1Description: SVN Datasheet; ComponentLink2URL: C:\ALTIUM_WORK\00001_MCHP-CDB\Datasheets\ECJ__General_.pdf; ComponentLink2Description: Local Datasheet; ComponentLink3URL: C:\ALTIUM_WORK\00001_MCHP-CDB\Library\LibraryRefs\Capacitor NP.SchLib; ComponentLink3Description: Open Symbol; ComponentLink4URL: C:\ALTIUM_WORK\00001_MCHP-CDB\Library\Footprints\CAP_C_0603.PcbLib; ComponentLink4Description: Open Footprint; ComponentLink5Description: Open Footprint 2; ComponentLink6Description: Open Footprint 3; ComponentLink7Description: Open Footprint 4; Operating Temperature: -55C to +85C; Category: Capacitor; Manufacturer 2: TDK Corporation; Manufacturer Part Number 2: C1608X5R1A106M; Manufacturer 3: Panasonic; Manufacturer Part Number 3: ECJ-1VB1A106M; Supplier 1: Digi-Key; Supplier Part Number 1: 1276-1871-1-ND; Supplier 2: Digi-Key; Supplier Part Number 2: 445-6853-1-ND; Supplier 3: Digi-Key; Supplier Part Number 3: PCC2479CT-ND; Quantity Override: 1
C100 C103 C105 C108 = CAP2026: Manufacturer 1: Murata Electronics North America; Manufacturer Part Number 1: GCM155R71H103KA55D; Voltage: 50V; Tolerance: 10%; Description_: CAP CER 10000pF 50V 10% X7R SMD 0402 AEC-Q200; Temperature Coeffcient: X7R; Type: Ceramic; Owner: Gabor Bihari; Populated: YES; Dev Tools Status: Production; MCHP-ID: CAP2026; Revision: 1; Status: MCL Design; Package: 0402; Operating Temperature: -55C to +125C; Category: Capacitor; Supplier 1: Digi-Key; Supplier Part Number 1: 490-4762-1-ND; Quantity Override: 1; Symbol: Capacitor NP; ComponentLink1URL: https://chn-vm-apps.microchip.com/mchprepo/parts/Datasheets/mlcc_automotive_general_en.pdf; ComponentLink1Description: SVN Datasheet; ComponentLink2URL: C:\ALTIUM_WORK\00001_MCHP-CDB\Datasheets\mlcc_automotive_general_en.pdf; ComponentLink2Description: Local Datasheet; ComponentLink3URL: C:\ALTIUM_WORK\00001_MCHP-CDB\Library\LibraryRefs\Capacitor NP.SchLib; ComponentLink3Description: Open Symbol; ComponentLink4URL: C:\ALTIUM_WORK\00001_MCHP-CDB\Library\Footprints\CAP_C_0402.PcbLib; ComponentLink4Description: Open Footprint; ComponentLink5Description: Open Footprint 2; ComponentLink6Description: Open Footprint 3; ComponentLink7Description: Open Footprint 4; Manufacturer 2: TDK Corporation; Manufacturer Part Number 2: CGA2B3X7R1H103K050BB; Supplier 2: Digi-Key; Supplier Part Number 2: 445-6893-1-ND
C101 C104 C106 C109 = CAP1033: Capacitor; Manufacturer 1: Murata; Manufacturer Part Number 1: GRM155R71C104KA88D; Voltage: 16V; Description_: CAP CER 0.1uF 16V 10% X7R SMD 0402; Tolerance: 10%; Temperature Coeffcient: X7R; Type: Ceramic; Owner: Sompoch Loboonlert; Populated: Yes; MCHP-ID: CAP1033; Package: 0402; Revision: 2; Status: Production; ComponentLink1URL: https://chn-vm-apps.microchip.com/mchprepo/parts/Datasheets/L0005E.pdf; ComponentLink1Description: Datasheet; Operating Temperature: -55C to +125C; Category: Capacitor; Supplier 1: Digi-Key; Supplier Part Number 1: 490-3261-2-ND; Quantity Override: 1
C102 C107 = CAP0542: Capacitor; Manufacturer 1: Samsung; Manufacturer Part Number 1: CL10A106MP8NNNC; Voltage: 10V; Description_: CAP CER 10uF 10V 20% X5R SMD 0603; Dev Tools Status: Production; Tolerance: 20%; Temperature Coeffcient: X5R; Type: Ceramic; Populated: Yes; MCHP-ID: CAP0542; Revision: 2; Symbol: Capacitor NP; Status: MCL Design; ComponentLink1URL: https://chn-vm-apps.microchip.com/mchprepo/parts/Datasheets/ECJ__General_.pdf; ComponentLink1Description: SVN Datasheet; ComponentLink2URL: C:\ALTIUM_WORK\00001_MCHP-CDB\Datasheets\ECJ__General_.pdf; ComponentLink2Description: Local Datasheet; ComponentLink3URL: C:\ALTIUM_WORK\00001_MCHP-CDB\Library\LibraryRefs\Capacitor NP.SchLib; ComponentLink3Description: Open Symbol; ComponentLink4URL: C:\ALTIUM_WORK\00001_MCHP-CDB\Library\Footprints\CAP_C_0603.PcbLib; ComponentLink4Description: Open Footprint; ComponentLink5Description: Open Footprint 2; ComponentLink6Description: Open Footprint 3; ComponentLink7Description: Open Footprint 4; Operating Temperature: -55C to +85C; Category: Capacitor; Manufacturer 2: TDK Corporation; Manufacturer Part Number 2: C1608X5R1A106M; Manufacturer 3: Panasonic; Manufacturer Part Number 3: ECJ-1VB1A106M; Supplier 1: Digi-Key; Supplier Part Number 1: 1276-1871-1-ND; Supplier 2: Digi-Key; Supplier Part Number 2: 445-6853-1-ND; Supplier 3: Digi-Key; Supplier Part Number 3: PCC2479CT-ND; Quantity Override: 1
L1 L101 = IND1886: Manufacturer 1: WURTH ELEKTRONIK; Manufacturer Part Number 1: 742792640; Description_: FERRITE BEAD 300Ohms@100MHz 300mA SMD 0603; Owner: Lori Graham; Populated: YES; Dev Tools Status: Design; DCR: 350mOhm; RMS Current: 300mA; Test Frequency: 100 MHz; MCHP-ID: IND1886; Revision: 1; Status: MCL Design; Type: Ferrite Bead; Category: Inductor; Supplier 1: Digi-Key; Supplier Part Number 1: 732-1578-1-ND; Quantity Override: 1; Symbol: Ferrite Bead; ComponentLink1URL: https://chn-vm-apps.microchip.com/mchprepo/parts/Datasheets/Wurth_742792640; ComponentLink1Description: SVN Datasheet; ComponentLink2URL: C:\ALTIUM_WORK\00001_MCHP-CDB\Datasheets\Wurth_742792640; ComponentLink2Description: Local Datasheet; ComponentLink3URL: C:\ALTIUM_WORK\00001_MCHP-CDB\Library\LibraryRefs\Ferrite Bead.SchLib; ComponentLink3Description: Open Symbol; ComponentLink4URL: C:\ALTIUM_WORK\00001_MCHP-CDB\Library\Footprints\IND_C_0603.PcbLib; ComponentLink4Description: Open Footprint; ComponentLink5Description: Open Footprint 2; ComponentLink6Description: Open Footprint 3; ComponentLink7Description: Open Footprint 4; Operating Temperature: -55°C ~ 125°C; Package: 0603
R5 = RSMT1019: Manufacturer 1: Panasonic; Manufacturer Part Number 1: ERJ-2RKF1002X; Description_: RES TKF 10k 1% 1/10W SMD 0402; Voltage: 50V; Power: 1/10W; Populated: Yes; Dev Tools Status: Production; Tolerance: 1%; Owner: Brent Lanphear; Temperature Coefficient: 100ppm/C; MCHP-ID: RSMT1019; Revision: 2; Status: MCL Design; ComponentLink1URL: https://chn-vm-apps.microchip.com/mchprepo/parts/Datasheets/AOA0000CE2.pdf; ComponentLink1Description: SVN Datasheet; Operating Temperature: -55C to +155C; Category: Resistor; Type: RES SMD; Composition: TKF; Supplier 1: Digi-Key; Supplier Part Number 1: P10.0KLCT-ND; Quantity Override: 1; Package: 0402; Symbol: Resistor; ComponentLink2URL: C:\ALTIUM_WORK\00001_MCHP-CDB\Datasheets\AOA0000CE2.pdf; ComponentLink2Description: Local Datasheet; ComponentLink3URL: C:\ALTIUM_WORK\00001_MCHP-CDB\Library\LibraryRefs\Resistor.SchLib; ComponentLink3Description: Open Symbol; ComponentLink4URL: C:\ALTIUM_WORK\00001_MCHP-CDB\Library\Footprints\RES_C_0402.PcbLib; ComponentLink4Description: Open Footprint; ComponentLink5Description: Open Footprint 2; ComponentLink6Description: Open Footprint 3; ComponentLink7Description: Open Footprint 4
R6 R9 = RSMT1246: as R1 on sheet Phy Daughter Board Header; MCHP-ID: RSMT1246; Revision: 1; Status: MCL Design; Package: 0402; Operating Temperature: -55C to +155C; Category: Resistor; Type: RES SMD; Composition: TKF; Supplier 1: Digi-Key; Supplier Part Number 1: P0.0JCT-ND; Quantity Override: 1; Symbol: Resistor; ComponentLink1URL: https://chn-vm-apps.microchip.com/mchprepo/parts/Datasheets/DMA0000COL9.pdf; ComponentLink1Description: SVN Datasheet; ComponentLink2URL: C:\ALTIUM_WORK\00001_MCHP-CDB\Datasheets\DMA0000COL9.pdf; ComponentLink2Description: Local Datasheet; ComponentLink3URL: C:\ALTIUM_WORK\00001_MCHP-CDB\Library\LibraryRefs\Resistor.SchLib; ComponentLink3Description: Open Symbol; ComponentLink4URL: C:\ALTIUM_WORK\00001_MCHP-CDB\Library\Footprints\RES_C_0402.PcbLib; ComponentLink4Description: Open Footprint; ComponentLink5Description: Open Footprint 2; ComponentLink6Description: Open Footprint 3; ComponentLink7Description: Open Footprint 4
R7 R13 R14 R116 = RSMT1019: Manufacturer 1: Panasonic; Manufacturer Part Number 1: ERJ-2RKF1002X; Tolerance: 1%; Description_: RES TKF 10k 1% 1/10W SMD 0402; Dev Tools Status: Production; Voltage: 50V; Power: 1/10W; Owner: Brent Lanphear; Populated: Yes; Temperature Coefficient: 100ppm/C; MCHP-ID: RSMT1019; Package: 0402; Revision: 2; Symbol: Resistor; Status: MCL Design; ComponentLink1URL: https://chn-vm-apps.microchip.com/mchprepo/parts/Datasheets/AOA0000CE2.pdf; ComponentLink1Description: SVN Datasheet; ComponentLink2URL: C:\ALTIUM_WORK\00001_MCHP-CDB\Datasheets\AOA0000CE2.pdf; ComponentLink2Description: Local Datasheet; ComponentLink3URL: C:\ALTIUM_WORK\00001_MCHP-CDB\Library\LibraryRefs\Resistor.SchLib; ComponentLink3Description: Open Symbol; ComponentLink4URL: C:\ALTIUM_WORK\00001_MCHP-CDB\Library\Footprints\RES_C_0402.PcbLib; ComponentLink4Description: Open Footprint; ComponentLink5Description: Open Footprint 2; ComponentLink6Description: Open Footprint 3; ComponentLink7Description: Open Footprint 4; Operating Temperature: -55C to +155C; Category: Resistor; Type: RES SMD; Composition: TKF; Supplier 1: Digi-Key; Supplier Part Number 1: P10.0KLCT-ND; Quantity Override: 1
R8 = RSMT1246: Resistor; Manufacturer 1: Panasonic Electronic Components; Manufacturer Part Number 1: ERJ-2GE0R00X; Description_: RES TKF 0R 1/10W SMD 0402; Tolerance: 50mOhm; Power: 1/10W; Owner: Dragos Danaila; Populated: YES; Dev Tools Status: Production; Voltage: 50V; Current: 1A; MCHP-ID: RSMT1246; Revision: 1; Status: MCL Design; Package: 0402; Operating Temperature: -55C to +155C; Category: Resistor; Type: RES SMD; Composition: TKF; Supplier 1: Digi-Key; Supplier Part Number 1: P0.0JCT-ND; Quantity Override: 1; Symbol: Resistor; ComponentLink1URL: https://chn-vm-apps.microchip.com/mchprepo/parts/Datasheets/DMA0000COL9.pdf; ComponentLink1Description: SVN Datasheet; ComponentLink2URL: C:\ALTIUM_WORK\00001_MCHP-CDB\Datasheets\DMA0000COL9.pdf; ComponentLink2Description: Local Datasheet; ComponentLink3URL: C:\ALTIUM_WORK\00001_MCHP-CDB\Library\LibraryRefs\Resistor.SchLib; ComponentLink3Description: Open Symbol; ComponentLink4URL: C:\ALTIUM_WORK\00001_MCHP-CDB\Library\Footprints\RES_C_0402.PcbLib; ComponentLink4Description: Open Footprint; ComponentLink5Description: Open Footprint 2; ComponentLink6Description: Open Footprint 3; ComponentLink7Description: Open Footprint 4
R10-R12 R118-R129 = RSMT1019: Manufacturer 1: Panasonic; Manufacturer Part Number 1: ERJ-2RKF1002X; Tolerance: 1%; Description_: RES TKF 10k 1% 1/10W SMD 0402; Dev Tools Status: Production; Voltage: 50V; Temperature Coeffcient: 100ppm/C; Power: 1/10W; Owner: Brent Lanphear; Populated: Yes; MCHP-ID: RSMT1019; Package: 0402; Revision: 2; Symbol: Resistor; Status: MCL Design; ComponentLink1URL: https://chn-vm-apps.microchip.com/mchprepo/parts/Datasheets/AOA0000CE2.pdf; ComponentLink1Description: SVN Datasheet; ComponentLink2URL: C:\ALTIUM_WORK\00001_MCHP-CDB\Datasheets\AOA0000CE2.pdf; ComponentLink2Description: Local Datasheet; ComponentLink3URL: C:\ALTIUM_WORK\00001_MCHP-CDB\Library\LibraryRefs\Resistor.SchLib; ComponentLink3Description: Open Symbol; ComponentLink4URL: C:\ALTIUM_WORK\00001_MCHP-CDB\Library\Footprints\RES_C_0402.PcbLib; ComponentLink4Description: Open Footprint; ComponentLink5Description: Open Footprint 2; ComponentLink6Description: Open Footprint 3; ComponentLink7Description: Open Footprint 4; Operating Temperature: -55C to +155C; Category: Resistor; Type: RES SMD; Composition: TKF; Supplier 1: Digi-Key; Supplier Part Number 1: P10.0KLCT-ND; Quantity Override: 1
R100-R102 = RES1462: Manufacturer 1: KOA Speer; Manufacturer Part Number 1: RK73H1ETTP4701F; Description_: RES TKF 4.7k 1% 1/10W 0402; Voltage: 50V; Temperature Coeffcient: 100ppm/C; Power: 1/10W; Populated: YES; Dev Tools Status: Production; Tolerance: 1%; Circuit Type: Isolated; Owner: Stephen Humberd; MCHP-ID: RES1462; Revision: 1; Status: MCL Design; ComponentLink1URL: https://chn-vm-apps.microchip.com/mchprepo/parts/Datasheets/RK73H.pdf; ComponentLink1Description: SVN Datasheet; Operating Temperature: -55C to +155C; Category: Resistor; Type: RES SMD; Composition: TKF; Supplier 1: Mouser; Supplier Part Number 1: 660-RK73H1ETTP4701F; Quantity Override: 1; Package: 0402; Symbol: Resistor; ComponentLink2URL: C:\ALTIUM_WORK\00001_MCHP-CDB\Datasheets\RK73H.pdf; ComponentLink2Description: Local Datasheet; ComponentLink3URL: C:\ALTIUM_WORK\00001_MCHP-CDB\Library\LibraryRefs\Resistor.SchLib; ComponentLink3Description: Open Symbol; ComponentLink4URL: C:\ALTIUM_WORK\00001_MCHP-CDB\Library\Footprints\RES_C_0402.PcbLib; ComponentLink4Description: Open Footprint; ComponentLink5Description: Open Footprint 2; ComponentLink6Description: Open Footprint 3; ComponentLink7Description: Open Footprint 4
R107-R109 = RES1474: Manufacturer 1: Panasonic Electronic Components; Manufacturer Part Number 1: ERJ-2RKF22R0X; Description_: RES TKF 22R 1% 1/20W SMD 0402; Tolerance: 1%; Temperature Coeffcient: 100ppm/C; Power: 1/10W; Owner: Mike Ragsdale; Populated: YES; Dev Tools Status: Production; Circuit Type: Isolated; MCHP-ID: RES1474; Revision: 1; Status: MCL Design; Package: 0402; Operating Temperature: -55C to +155C; Category: Resistor; Type: RES SMD; Composition: TKF; Supplier 1: Digi-Key; Supplier Part Number 1: P22.0LCT-ND; Quantity Override: 1; Symbol: Resistor; ComponentLink1Description: SVN Datasheet; ComponentLink2Description: Local Datasheet; ComponentLink3URL: C:\ALTIUM_WORK\00001_MCHP-CDB\Library\LibraryRefs\Resistor.SchLib; ComponentLink3Description: Open Symbol; ComponentLink4URL: C:\ALTIUM_WORK\00001_MCHP-CDB\Library\Footprints\RES_C_0402.PcbLib; ComponentLink4Description: Open Footprint; ComponentLink5Description: Open Footprint 2; ComponentLink6Description: Open Footprint 3; ComponentLink7Description: Open Footprint 4
R114 = RES2767: Manufacturer 1: Panasonic Electronic Components; Manufacturer Part Number 1: ERJ-2RKF1242X; Description_: RES TKF 12.4K 1% 1/10W SMD 0402 AEC-Q200; Tolerance: ±1%; Temperature Coeffcient: ±100ppm/°C; Power: 1/10W; Owner: Lori Graham; Populated: YES; Dev Tools Status: Design; Voltage: 100V; MCHP-ID: RES2767; Revision: 1; Status: MCL Design; Package: 0402; Operating Temperature: -55°C to +155°C; Category: Resistor; Type: RES SMD; Supplier 1: Digi-Key; Supplier Part Number 1: P12.4KLCT-ND; Quantity Override: 1; Symbol: Resistor; ComponentLink1URL: https://chn-vm-apps.microchip.com/mchprepo/parts/Datasheets/Panasonic_RES_ERJ_Series; ComponentLink1Description: SVN Datasheet; ComponentLink2URL: C:\ALTIUM_WORK\00001_MCHP-CDB\Datasheets\Panasonic_RES_ERJ_Series; ComponentLink2Description: Local Datasheet; ComponentLink3URL: C:\ALTIUM_WORK\00001_MCHP-CDB\Library\LibraryRefs\Resistor.SchLib; ComponentLink3Description: Open Symbol; ComponentLink4URL: C:\ALTIUM_WORK\00001_MCHP-CDB\Library\Footprints\RES_C_0402.PcbLib; ComponentLink4Description: Open Footprint; ComponentLink5Description: Open Footprint 2; ComponentLink6Description: Open Footprint 3; ComponentLink7Description: Open Footprint 4; Composition: TKF
TP1-TP6 = AIS-CON0024: Test Point; Value: TP PAD RD 0.5mm SMD; Description_: TP Pad PCB round 0.5mm SMD; Owner: JBU  (M21065); Populated: Yes; MCHP-ID: AIS-CON0024; Revision: 1; Type: Test Point; Category: Connector; Quantity Override: 1
U100 = IC2413: Manufacturer 1: Microchip Technology; MCHP-ID: IC2413; Description_: MCHP INTERFACE 10BASE-T1S ETHERNET LAN8670C2 VQFN-32; Owner: Lori Cantrell; Populated: YES; Dev Tools Status: Design; Revision: 1; Status: MCL Design; Type: Ethernet; Category: MCHP-Interface; Manufacturer Part Number 1: LAN8670C2; Supplier 1: Microchip Technology; Supplier Part Number 1: LAN8670C2; Quantity Override: 1; Symbol: LAN8670C VQFN-32; ComponentLink1URL: https://chn-vm-apps.microchip.com/mchprepo/parts/Datasheets/LAN8670_1_2.pdf; ComponentLink1Description: SVN Datasheet; ComponentLink2URL: C:\ALTIUM_WORK\00001_MCHP-CDB\Datasheets\LAN8670_1_2.pdf; ComponentLink2Description: Local Datasheet; ComponentLink3URL: C:\ALTIUM_WORK\00001_MCHP-CDB\Library\LibraryRefs\LAN8670C VQFN-32.SchLib; ComponentLink3Description: Open Symbol; ComponentLink4URL: C:\ALTIUM_WORK\00001_MCHP-CDB\Library\Footprints\VQFN-32_5x5_EP3.3x3.3.PcbLib; ComponentLink4Description: Open Footprint; ComponentLink5Description: Open Footprint 2; ComponentLink6Description: Open Footprint 3; ComponentLink7Description: Open Footprint 4; Operating Temperature: -40C ~ 125C (TA); Restricted Sourcing: Yes

## Sheet Mechanical.SchDoc
size A; CompanyName: Microchip Technology Inc.; Organization: Microchip Technology; Address1: 2355 West Chandler Blvd.; Address2: Chandler, AZ  85224; Address4: USA; DocumentNumber: 5; SheetNumber: 5; SheetTotal: 5; SheetTitle: Mechanical; Time: Time
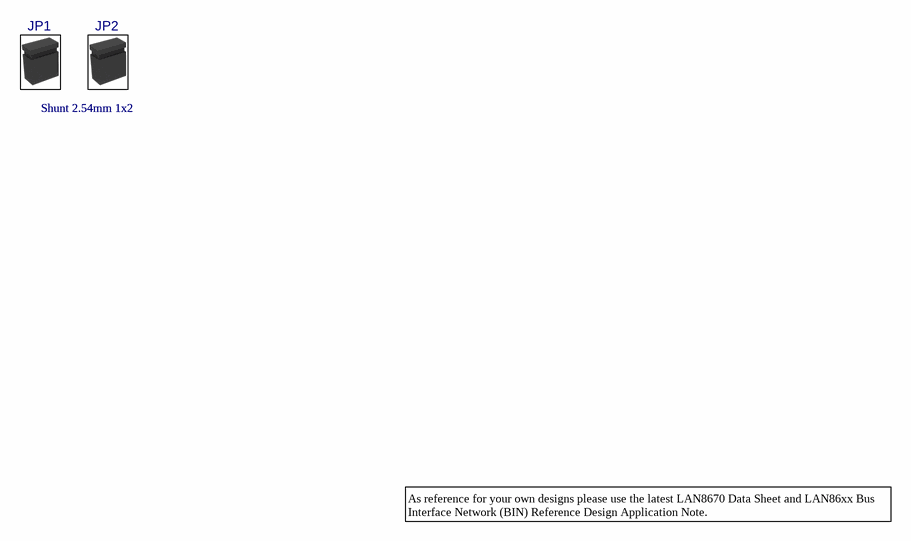
[diagram p4: Mechanical.SchDoc]

### Parts
JP1  value Shunt 2.54mm 1x2  (hidden comment: Jumper Mechanical Closed Top)  (mechanical)
JP2  value Shunt 2.54mm 1x2  (hidden comment: Jumper Mechanical Closed Top)  (mechanical)

### Notes on the sheet
- As reference for your own designs please use the latest LAN8670 Data Sheet and LAN86xx Bus Interface Network (BIN) Reference Design Application Note.
- Project Owner:
- PCB Layout Contact:
- PartNumber:
- Project Title
- Variant:
- Sheet Title
- Size
- A
- SCH #:
- PCB #:
- Rev:
- Date:
- Sheet
- Designed with
- Altium.com <http://go.altium.com/MicrochipLandingPage_Evaluation.html>
- File:

### Library data of the parts
JP1 JP2 = HW1016: Jumper Shorting; Manufacturer 1: Sullins Connector Solutions; Manufacturer Part Number 1: SSC02SYAN; MCHP-ID: HW1016; Description_: MECH HW JUMPER 2.54mm 1x2 GOLD CLOSED TOP; Dev Tools Status: Design; Owner: Lori Graham; Populated: MECH; Revision: 1; Symbol: Jumper Mechanical Closed Top; Status: MCL Design; ComponentLink1URL: https://chn-vm-apps.microchip.com/mchprepo/parts/Datasheets/S_C02SYAN.pdf; ComponentLink1Description: SVN Datasheet; ComponentLink2URL: C:\ALTIUM_WORK\00001_MCHP-CDB\Datasheets\S_C02SYAN.pdf; ComponentLink2Description: Local Datasheet; ComponentLink3URL: C:\ALTIUM_WORK\00001_MCHP-CDB\Library\LibraryRefs\Jumper Mechanical Closed Top.SchLib; ComponentLink3Description: Open Symbol; ComponentLink4Description: Open Footprint; ComponentLink5Description: Open Footprint 2; ComponentLink6Description: Open Footprint 3; ComponentLink7Description: Open Footprint 4; Type: Jumper; Category: Hardware; Supplier 1: Digi-Key; Supplier Part Number 1: S9002-ND; Quantity Override: 1

## Nets that join several sheets
3V3: Phy Daughter Board Header (J3.10 R4.1), LAN8670 Watson (17 pins)
GND: BIN (6 pins), Phy Daughter Board Header (8 pins), LAN8670 Watson (28 pins)
VBAT: Phy Daughter Board Header (R3.1 R4.2), LAN8670 Watson (L1.2)
ACMA: Phy Daughter Board Header (J3.11), LAN8670 Watson (R8.1)
CLK50M: Phy Daughter Board Header (J3.8), LAN8670 Watson (U100.27)
CRSDV: Phy Daughter Board Header (J4.6), LAN8670 Watson (R125.1 R126.1 U100.20)
GPIO0: Phy Daughter Board Header (J3.12), LAN8670 Watson (R6.1)
INH: Phy Daughter Board Header (R1.2), LAN8670 Watson (R12.2 TP1.1 U100.1)
MDC: Phy Daughter Board Header (J4.7), LAN8670 Watson (R100.1 U100.13)
MDIO: Phy Daughter Board Header (J4.8), LAN8670 Watson (R101.1 U100.14)
nINT: Phy Daughter Board Header (J4.9), LAN8670 Watson (R102.1 U100.22)
nRST: Phy Daughter Board Header (J4.10), LAN8670 Watson (R116.1 U100.10)
RXD0: Phy Daughter Board Header (J4.4), LAN8670 Watson (R107.1 R123.1 R124.1)
RXD1: Phy Daughter Board Header (J4.3), LAN8670 Watson (R108.1 R121.1 R122.1)
RXER: Phy Daughter Board Header (J4.5), LAN8670 Watson (R109.1 R127.1 R128.1)
RXPI: Phy Daughter Board Header (J4.12), LAN8670 Watson (R9.1)
TRX_N: BIN (L200.1 R204.1), LAN8670 Watson (U100.31)
TRX_P: BIN (L200.2 R205.1), LAN8670 Watson (U100.30)
TXD0: Phy Daughter Board Header (J3.2), LAN8670 Watson (U100.6)
TXD1: Phy Daughter Board Header (J3.3), LAN8670 Watson (U100.5)
TXEN: Phy Daughter Board Header (J3.1), LAN8670 Watson (R129.2 U100.7)
WAKE_IN: Phy Daughter Board Header (J4.1), LAN8670 Watson (R5.2 R11.2 TP2.1 U100.32)
WAKE_OUT: Phy Daughter Board Header (R2.2), LAN8670 Watson (R14.2 TP5.1 U100.17)

## Assembly variants
Demo Opt BIN 120: not fitted R2 R3 R5 R121 R123 R125 R127 R204 R205